# Altium schematic sheet 12.MCU.SchDoc
size A4; SheetNumber: 13; SheetTotal: 13
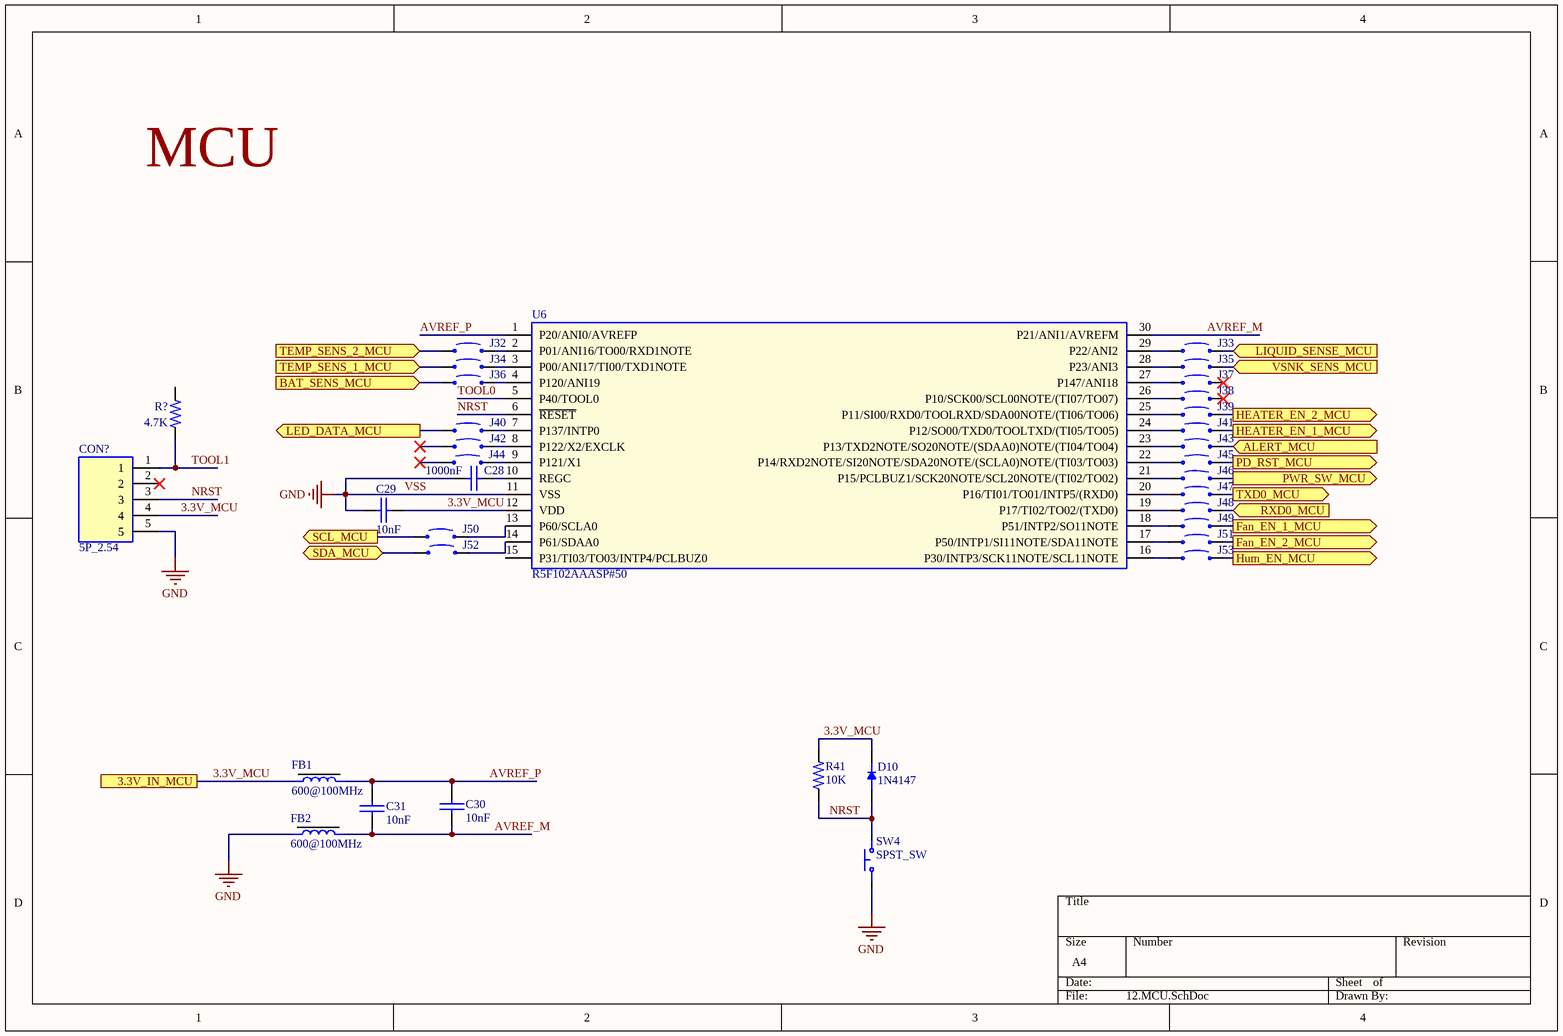
[diagram p0: 12.MCU.SchDoc]

## Parts
C28  1000nF  [C_0603]
C29  10nF  [C_0603]
C30  10nF  [C_0603]
C31  10nF  [C_0603]
CON?  5P_2.54  [5P2.54]
D10  1N4147  [SOD123]
FB1  600@100MHz  [FB0402]
FB2  600@100MHz  [FB0402]
J32  OPEN_JMP  [OPEN_JMP]  (value not drawn)
J33  OPEN_JMP  [OPEN_JMP]  (value not drawn)
J34  OPEN_JMP  [OPEN_JMP]  (value not drawn)
J35  OPEN_JMP  [OPEN_JMP]  (value not drawn)
J36  OPEN_JMP  [OPEN_JMP]  (value not drawn)
J37  OPEN_JMP  [OPEN_JMP]  (value not drawn)
J38  OPEN_JMP  [OPEN_JMP]  (value not drawn)
J39  OPEN_JMP  [OPEN_JMP]  (value not drawn)
J40  OPEN_JMP  [OPEN_JMP]  (value not drawn)
J41  OPEN_JMP  [OPEN_JMP]  (value not drawn)
J42  OPEN_JMP  [OPEN_JMP]  (value not drawn)
J43  OPEN_JMP  [OPEN_JMP]  (value not drawn)
J44  OPEN_JMP  [OPEN_JMP]  (value not drawn)
J45  OPEN_JMP  [OPEN_JMP]  (value not drawn)
J46  OPEN_JMP  [OPEN_JMP]  (value not drawn)
J47  OPEN_JMP  [OPEN_JMP]  (value not drawn)
J48  OPEN_JMP  [OPEN_JMP]  (value not drawn)
J49  OPEN_JMP  [OPEN_JMP]  (value not drawn)
J50  OPEN_JMP  [OPEN_JMP]  (value not drawn)
J51  OPEN_JMP  [OPEN_JMP]  (value not drawn)
J52  OPEN_JMP  [OPEN_JMP]  (value not drawn)
J53  OPEN_JMP  [OPEN_JMP]  (value not drawn)
R41  10K  [R_0603]
R?  4.7K  [R_0603]
SW4  SPST_SW  [PTS636 SM43J SMTR LFS]
U6  R5F102AAASP#50  [LSSOP-30]

## Ports
3.3V_IN_MCU, ALERT_MCU (in), BAT_SENS_MCU (in), Fan_EN_1_MCU (out), Fan_EN_2_MCU (out), HEATER_EN_1_MCU (out), HEATER_EN_2_MCU (out), Hum_EN_MCU (out), LED_DATA_MCU (out), LIQUID_SENSE_MCU (in), PD_RST_MCU (out), PWR_SW_MCU (out), RXD0_MCU (in), SCL_MCU (out), SDA_MCU (bidir), TEMP_SENS_1_MCU (in), TEMP_SENS_2_MCU (in), TXD0_MCU (out), VSNK_SENS_MCU (in)

## Nets
VSS: C28.1 C29.1 CON?.5 FB2.1 SW4.1(COM) U6.11(VSS)  [also labelled GND]
3.3V_MCU: C29.2 CON?.4 D10.C(K) FB1.1 R41.2 U6.12(VDD) ; port 3.3V_IN_MCU
ALERT_MCU: J43.2 ; port ALERT_MCU
AVREF_M: C30.1 C31.1 FB2.2 U6.30(P21/ANI1/AVREFM)
AVREF_P: C30.2 C31.2 FB1.2 U6.1(P20/ANI0/AVREFP)
BAT_SENS_MCU: J36.1 ; port BAT_SENS_MCU
Fan_EN_1_MCU: J49.2 ; port Fan_EN_1_MCU
Fan_EN_2_MCU: J51.2 ; port Fan_EN_2_MCU
HEATER_EN_1_MCU: J41.2 ; port HEATER_EN_1_MCU
HEATER_EN_2_MCU: J39.2 ; port HEATER_EN_2_MCU
Hum_EN_MCU: J53.2 ; port Hum_EN_MCU
LED_DATA_MCU: J40.1 ; port LED_DATA_MCU
LIQUID_SENSE_MCU: J33.2 ; port LIQUID_SENSE_MCU
NRST: CON?.3 D10.A R41.1 SW4.2(NO) U6.6(~{RESET})
PD_RST_MCU: J45.2 ; port PD_RST_MCU
PWR_SW_MCU: J46.2 ; port PWR_SW_MCU
RXD0_MCU: J48.2 ; port RXD0_MCU
SCL_MCU: J50.1 ; port SCL_MCU
SDA_MCU: J52.1 ; port SDA_MCU
TEMP_SENS_1_MCU: J34.1 ; port TEMP_SENS_1_MCU
TEMP_SENS_2_MCU: J32.1 ; port TEMP_SENS_2_MCU
TOOL0: U6.5(P40/TOOL0)
TOOL1: CON?.1 R?.1
TXD0_MCU: J47.2 ; port TXD0_MCU
VSNK_SENS_MCU: J35.2 ; port VSNK_SENS_MCU
NetC28_2: C28.2 U6.10(REGC)
NetJ32_2: J32.2 U6.2(P01/ANI16/TO00/RXD1NOTE)
NetJ33_1: J33.1 U6.29(P22/ANI2)
NetJ34_2: J34.2 U6.3(P00/ANI17/TI00/TXD1NOTE)
NetJ35_1: J35.1 U6.28(P23/ANI3)
NetJ36_2: J36.2 U6.4(P120/ANI19)
NetJ37_1: J37.1 U6.27(P147/ANI18)
NetJ38_1: J38.1 U6.26(P10/SCK00/SCL00NOTE/(TI07/TO07))
NetJ39_1: J39.1 U6.25(P11/SI00/RXD0/TOOLRXD/SDA00NOTE/(TI06/TO06))
NetJ40_2: J40.2 U6.7(P137/INTP0)
NetJ41_1: J41.1 U6.24(P12/SO00/TXD0/TOOLTXD/(TI05/TO05))
NetJ42_2: J42.2 U6.8(P122/X2/EXCLK)
NetJ43_1: J43.1 U6.23(P13/TXD2NOTE/SO20NOTE/(SDAA0)NOTE/(TI04/TO04))
NetJ44_2: J44.2 U6.9(P121/X1)
NetJ45_1: J45.1 U6.22(P14/RXD2NOTE/SI20NOTE/SDA20NOTE/(SCLA0)NOTE/(TI03/TO03))
NetJ46_1: J46.1 U6.21(P15/PCLBUZ1/SCK20NOTE/SCL20NOTE/(TI02/TO02))
NetJ47_1: J47.1 U6.20(P16/TI01/TO01/INTP5/(RXD0))
NetJ48_1: J48.1 U6.19(P17/TI02/TO02/(TXD0))
NetJ49_1: J49.1 U6.18(P51/INTP2/SO11NOTE)
NetJ50_2: J50.2 U6.13(P60/SCLA0)
NetJ51_1: J51.1 U6.17(P50/INTP1/SI11NOTE/SDA11NOTE)
NetJ52_2: J52.2 U6.14(P61/SDAA0)
NetJ53_1: J53.1 U6.16(P30/INTP3/SCK11NOTE/SCL11NOTE)

Not connected (* = marked no-connect by the designer): CON? 2*; J37 2*; J38 2*; J42 1*; J44 1*; R? 2; U6 15(P31/TI03/TO03/INTP4/PCLBUZ0)

## Notes on the sheet
- MCU

## Library data of the parts
C28-C31 = C_0603: D: *; MFR: *; P: *; PN: *; URL: *
CON? = 5P_2.54: PN: 87224-5
D10 = 1N4147: MFR: Panjit; PN: 1N4148W_R2_00001; D: Diodes - General Purpose, Power, Switching SURFACE MOUNT SWITCHING DIODES; P: SOD123; URL: https://www.mouser.in/ProductDetail/Panjit/1N4148W_R2_00001?qs=sPbYRqrBIVlsNrvmMQOkFA%3D%3D
FB1 FB2 = FB0402: MFR: Murata Electronics; P: 0402; PN: BLM15HG601SN1D; D: Ferrite Beads 600 OHM 25%; URL: https://www.mouser.in/ProductDetail/Murata-Electronics/BLM15HG601SN1D?qs=0VEDk56ETTplQiBGmxjbtg%3D%3D
R41 R? = R_0603: D: *; MFR: *; P: *; PN: *; URL: *
SW4 = SPST_SW: MFR: C&K; D: Tactile Switches Tact 50mA 12VDC, 6.0x3.5, 4.3mm H, 180gf, J leads, No ground pin, Black Actuator; PN: PTS636 SM43J SMTR LFS; P: *; URL: https://www.mouser.in/ProductDetail/CK/PTS636-SM43J-SMTR-LFS?qs=vLWxofP3U2wboJ6ciMafNg%3D%3D
U6 = R5F102AAASP#50: MFR: Renesas Electronics; D: 16-bit Microcontrollers - MCU 16BIT MCU RL78/G12 16K 30LSSOP -40/+85C; PN: R5F102AAASP#50; P: LSSOP-30; URL: https://www.mouser.in/ProductDetail/Renesas-Electronics/R5F102AAASP50?qs=EBDBlbfErPyLiV42bLqAfw%3D%3D